# Altium schematic sheet pca63557_sheet3_motor.SchDoc: =BoardTitle
size A4; Organization: Nordic Semiconductor; DocumentNumber: 3; SheetNumber: 3; SheetTotal: 4; CompanyName: Nordic Semiconductor; DocumentSize: A4
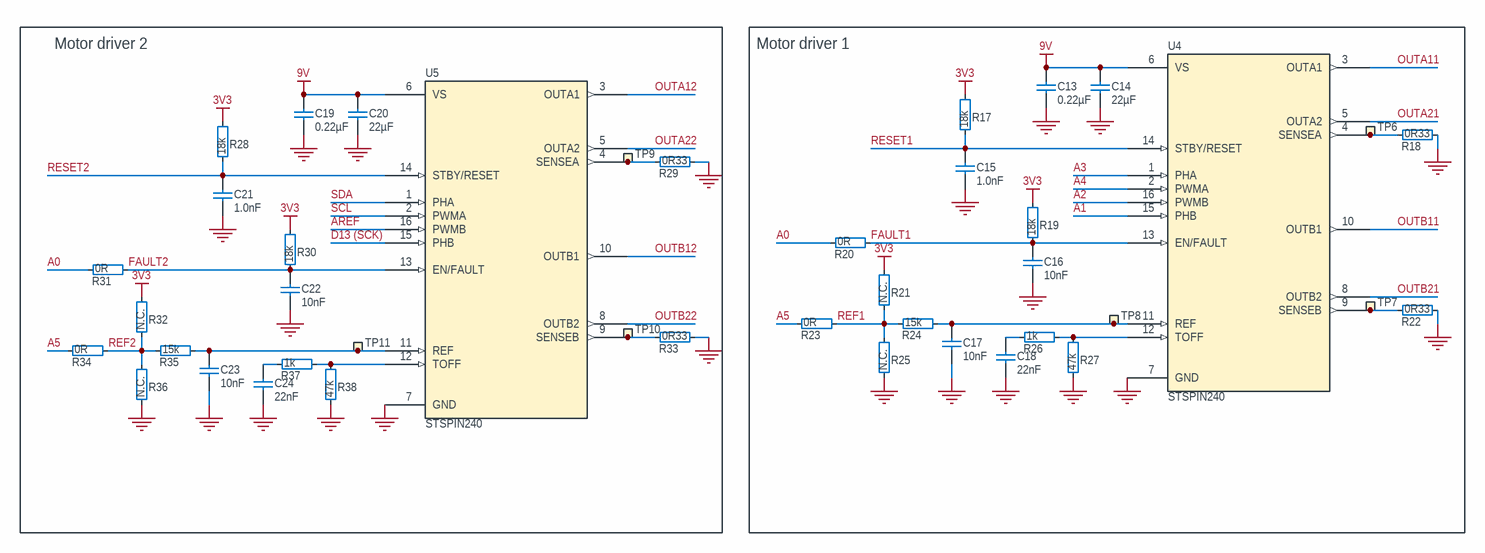
[diagram p0: pca63557_sheet3_motor.SchDoc]

## Parts
C13  0.22µF  [CAPC1005X04L]
C14  22µF  [CAPC1608X06L]
C15  1.0nF  [CAPC1005X04L]
C16  10nF  [CAPC1005X04L]
C17  10nF  [CAPC1005X04L]
C18  22nF  [CAPC1005X04L]
C19  0.22µF  [CAPC1005X04L]
C20  22µF  [CAPC1608X06L]
C21  1.0nF  [CAPC1005X04L]
C22  10nF  [CAPC1005X04L]
C23  10nF  [CAPC1005X04L]
C24  22nF  [CAPC1005X04L]
R17  18k  [RESC1005X04L]
R18  0R33  [RESC3216X08N]
R19  18k  [RESC1005X04L]
R20  0R  [RESC1005X04L]
R21  N.C.  [RESC1005X04L_NC]
R22  0R33  [RESC3216X08N]
R23  0R  [RESC1005X04L]
R24  15k  [RESC1005X04L]
R25  N.C.  [RESC1005X04L_NC]
R26  1k  [RESC1005X04L]
R27  47k  [RESC1005X04L]
R28  18k  [RESC1005X04L]
R29  0R33  [RESC3216X08N]
R30  18k  [RESC1005X04L]
R31  0R  [RESC1005X04L]
R32  N.C.  [RESC1005X04L_NC]
R33  0R33  [RESC3216X08N]
R34  0R  [RESC1005X04L]
R35  15k  [RESC1005X04L]
R36  N.C.  [RESC1005X04L_NC]
R37  1k  [RESC1005X04L]
R38  47k  [RESC1005X04L]
TP6  Ø1.5mm,SMD  [TP_SMD_D1.5mm]  (value not drawn)  (no BOM)
TP7  Ø1.5mm,SMD  [TP_SMD_D1.5mm]  (value not drawn)  (no BOM)
TP8  Ø1.5mm,SMD  [TP_SMD_D1.5mm]  (value not drawn)  (no BOM)
TP9  Ø1.5mm,SMD  [TP_SMD_D1.5mm]  (value not drawn)  (no BOM)
TP10  Ø1.5mm,SMD  [TP_SMD_D1.5mm]  (value not drawn)  (no BOM)
TP11  Ø1.5mm,SMD  [TP_SMD_D1.5mm]  (value not drawn)  (no BOM)
U4  STSPIN240  [STSPIN240]
U5  STSPIN240  [STSPIN240]

## Blocks framed on the sheet
Motor driver 2: C19-C24 R28-R38 TP9-TP11 U5
Motor driver 1: C13-C18 R17-R27 TP6-TP8 U4

## Nets
3V3: R17.2 R19.2 R21.2 R28.2 R30.2 R32.2
9V: C13.2 C14.2 C19.2 C20.2 U4.6(VS) U5.6(VS)
GND: C13.1 C14.1 C15.1 C16.1 C17.1 C18.1 C19.1 C20.1 C21.1 C22.1 C23.1 C24.1 R18.2 R22.2 R25.1 R27.1 R29.2 R33.2 R36.1 R38.1 U4.7(GND) U5.7(GND)
A0: R20.1 R31.1
A1: U4.15(PHB)
A2: U4.16(PWMB)
A3: U4.1(PHA)
A4: U4.2(PWMA)
A5: R23.1 R34.1
AREF: U5.16(PWMB)
D13 (SCK): U5.15(PHB)
FAULT1: C16.2 R19.1 R20.2 U4.13(EN/FAULT)
FAULT2: C22.2 R30.1 R31.2 U5.13(EN/FAULT)
OUTA11: U4.3(OUTA1)
OUTA12: U5.3(OUTA1)
OUTA21: U4.5(OUTA2)
OUTA22: U5.5(OUTA2)
OUTB11: U4.10(OUTB1)
OUTB12: U5.10(OUTB1)
OUTB21: U4.8(OUTB2)
OUTB22: U5.8(OUTB2)
REF1: R21.1 R23.2 R24.1 R25.2
REF2: R32.1 R34.2 R35.1 R36.2
RESET1: C15.2 R17.1 U4.14(STBY/RESET)
RESET2: C21.2 R28.1 U5.14(STBY/RESET)
SCL: U5.2(PWMA)
SDA: U5.1(PHA)
NetC17_2: C17.2 R24.2 TP8.1 U4.11(REF)
NetC18_2: C18.2 R26.1
NetC23_2: C23.2 R35.2 TP11.1 U5.11(REF)
NetC24_2: C24.2 R37.1
NetR18_1: R18.1 TP6.1 U4.4(SENSEA)
NetR22_1: R22.1 TP7.1 U4.9(SENSEB)
NetR26_2: R26.2 R27.2 U4.12(TOFF)
NetR29_1: R29.1 TP9.1 U5.4(SENSEA)
NetR33_1: R33.1 TP10.1 U5.9(SENSEB)
NetR37_2: R37.2 R38.2 U5.12(TOFF)

## Notes on the sheet
- Title
- Size
- Date:
- File:
- A4
- PCB Assembly Number
- Sheet         of
- Drawn By:
- Revision
- Classification:

## Library data of the parts
C13 C19 = C0402-0.22µ-16V-X7R-CL05B224KO5NNNC: Capacitor, X7R, ±0.10%, 16V; Manufacturer: Samsung Electro-Mechanics; Part number NEMS: 100200508; Component Status: Active; Pad Count: 2; Artikkelnr Noca: N.A.; Part Number: C0402-0.22µ-16V-X7R-CL05B224KO5NNNC; Component Class: Capacitors; Author: mam1; Manufacturer Part Number: CL05B224KO5NNNC; ComponentLink1URL: https://media.digikey.com/pdf/Data%20Sheets/Samsung%20PDFs/CL05B224KO5NNNC_Spec.pdf; ComponentLink1Description: Datasheet; ComponentLink2URL: https://www.digikey.no/en/products/detail/samsung-electro-mechanics/CL05B224KO5NNNC/3886834; ComponentLink2Description: Supplier link; HelpURL: N.A.; Footprint Doc: 0402; LatestRevisionDate: 2022-06-20; Published: 2022-06-20; Value: 0.22µF; Note: 16V; Supplier 1: Digi-Key; Supplier Part Number 1: 1276-1176-1-ND; Supplier 2: N.A.; Supplier Part Number 2: N.A.; Part number IPS: N.A.; Part number Norautron: N.A.; PartId: 100200508
C14 C20 = C0603-22µ-16V-X5R-CL10A226MO7JZNC: Capacitor, X5R, ±0.20%, 16V; Manufacturer: Samsung Electro-Mechanics; Part number NEMS: 100200507; Component Status: Active; Pad Count: 2; Artikkelnr Noca: N.A.; Part Number: C0603-22µ-16V-X5R-CL10A226MO7JZNC; Component Class: Capacitors; Author: mam1; Manufacturer Part Number: CL10A226MO7JZNC; ComponentLink1URL: https://media.digikey.com/pdf/Data%20Sheets/Samsung%20PDFs/CL10A226MO7JZNC_Spec.pdf; ComponentLink1Description: Datasheet; ComponentLink2URL: https://www.digikey.no/en/products/detail/samsung-electro-mechanics/CL10A226MO7JZNC/7320581; ComponentLink2Description: Supplier link; HelpURL: N.A.; Footprint Doc: 0603; LatestRevisionDate: 2022-06-20; Published: 2022-06-20; Value: 22µF; Note: 16V; Supplier 1: Digi-Key; Supplier Part Number 1: 1276-7076-1-ND; Supplier 2: N.A.; Supplier Part Number 2: N.A.; Part number IPS: N.A.; Part number Norautron: N.A.; PartId: 100200507
C15 C21 = C0402-1n0: Capacitor, X7R, ±10%; Manufacturer: N.A.; Part number NEMS: 100200162; Component Status: Active; Pad Count: 2; Note: 50V; Artikkelnr Noca: 20039223; Part Number: C0402-1n0; PartId: 100200162; Component Class: Capacitors; Author: rsk; Manufacturer Part Number: N.A.; ComponentLink1URL: N.A.; ComponentLink1Description: Datasheet; ComponentLink2URL: N.A.; ComponentLink2Description: Supplier link; HelpURL: N.A.; Footprint Doc: 0402; LatestRevisionDate: 2009-11-23; Published: 2009-05-08; Value: 1.0nF; Supplier 1: N.A.; Supplier Part Number 1: N.A.; Supplier 2: N.A.; Supplier Part Number 2: N.A.; Part number IPS: N.A.; Part number Norautron: N.A.
C16 C17 C22 C23 = C0402-10n: Capacitor, X7R, ±10%; Manufacturer: N.A.; Part number IPS: 00000007784; Part number NEMS: 100200173; Component Status: Active; Pad Count: 2; Note: 16V; Artikkelnr Noca: 20039166; Part Number: C0402-10n; PartId: 100200173; Component Class: Capacitors; Author: rsk; Manufacturer Part Number: N.A.; ComponentLink1URL: N.A.; ComponentLink1Description: Datasheet; ComponentLink2URL: N.A.; ComponentLink2Description: Supplier link; HelpURL: N.A.; Footprint Doc: 0402; LatestRevisionDate: 2009-11-23; Published: 2009-05-08; Value: 10nF; Supplier 1: N.A.; Supplier Part Number 1: N.A.; Supplier 2: N.A.; Supplier Part Number 2: N.A.; Part number Norautron: N.A.
C18 C24 = C0402-22n: Capacitor, X7R, ±10%; Manufacturer: N.A.; Part number NEMS: 100200177; Component Status: Active; Pad Count: 2; Note: 50V; Artikkelnr Noca: 20039316; Part Number: C0402-22n; PartId: 100200177; Component Class: Capacitors; Author: rsk; Manufacturer Part Number: N.A.; ComponentLink1URL: N.A.; ComponentLink1Description: Datasheet; ComponentLink2URL: N.A.; ComponentLink2Description: Supplier link; HelpURL: N.A.; Footprint Doc: 0402; LatestRevisionDate: 2009-05-08; Published: 2009-05-08; Value: 22nF; Supplier 1: N.A.; Supplier Part Number 1: N.A.; Supplier 2: N.A.; Supplier Part Number 2: N.A.; Part number IPS: N.A.; Part number Norautron: N.A.
R17 R19 R28 R30 = R0402-18k: Resistor, ±1%, 0.063W; Manufacturer: N.A.; Part number IPS: 00000003300; Part number NEMS: 100100208; Component Status: Active; Pad Count: 2; Note: Chip Res 1%; Artikkelnr Noca: 27049103; Part Number: R0402-18k; PartId: 100100208; Component Class: Resistors; Author: rsk; Manufacturer Part Number: N.A.; ComponentLink1URL: N.A.; ComponentLink1Description: Datasheet; ComponentLink2URL: N.A.; ComponentLink2Description: Supplier link; HelpURL: N.A.; Footprint Doc: 0402; LatestRevisionDate: 2009-11-23; Published: 2009-05-08; Value: 18k; Supplier 1: Farnell; Supplier Part Number 1: 173-8867; Supplier 2: N.A.; Supplier Part Number 2: N.A.; Part number Norautron: N.A.
R18 R22 R29 R33 = R1206-0R33-0.5%-1W-HRG3216P-3300-D-T1: 330 Ohms ±0.5% 1W Chip Resistor 1206 (3216 Metric); Manufacturer: Susumu; Part number NEMS: 100100668; Component Status: Active; Pad Count: 2; Note: 0R33 0.5% 1W; Artikkelnr Noca: N.A.; Part Number: R1206-0R33-0.5%-1W-HRG3216P-3300-D-T1; Component Class: Resistors; Author: mam1; Manufacturer Part Number: HRG3216P-3300-D-T1; ComponentLink1URL: https://www.susumu.co.jp/common/pdf/n_catalog_partition24_en.pdf; ComponentLink1Description: Datasheet; ComponentLink2URL: https://www.digikey.no/en/products/detail/susumu/HRG3216P-3300-D-T1/5762512; ComponentLink2Description: Supplier link; HelpURL: N.A.; Footprint Doc: 1206; LatestRevisionDate: 2022-06-20; Published: 2022-06-20; Value: 0R33; Supplier 1: Digi-Key; Supplier Part Number 1: 408-1913-1-ND; Supplier 2: N.A.; Supplier Part Number 2: N.A.; Part number IPS: N.A.; Part number Norautron: N.A.; PartId: 100100668
R20 R23 R31 R34 = R0402-0R: Resistor, ±5%, 0.063W; Manufacturer: N.A.; Part number IPS: 00000007128; Part number NEMS: 100100109; Component Status: Active; Pad Count: 2; Note: Chip Res 5%; Artikkelnr Noca: 27049000; Part Number: R0402-0R; PartId: 100100109; Component Class: Resistors; Author: rsk; Manufacturer Part Number: N.A.; ComponentLink1URL: N.A.; ComponentLink1Description: Datasheet; ComponentLink2URL: N.A.; ComponentLink2Description: Supplier link; HelpURL: N.A.; Footprint Doc: 0402; LatestRevisionDate: 2009-11-23; Published: 2009-05-08; Value: 0R; Supplier 1: Farnell; Supplier Part Number 1: 146-9661; Supplier 2: N.A.; Supplier Part Number 2: N.A.; Part number Norautron: N.A.
R21 R25 R32 R36 = R0402-N.C.: Not mounted; Manufacturer: N.A.; Part number NEMS: 100100281; Component Status: Active; Pad Count: 2; Note: Chip Res; Assembly: Not mounted; Part Number: R0402-N.C.; PartId: 100100281; Component Class: Resistors; Author: rsk; Manufacturer Part Number: N.A.; ComponentLink1URL: N.A.; ComponentLink1Description: Datasheet; ComponentLink2URL: N.A.; ComponentLink2Description: Supplier link; HelpURL: N.A.; Footprint Doc: 0402; LatestRevisionDate: 2009-05-08; Published: 2009-05-08; Value: N.C.; Supplier 1: N.A.; Supplier Part Number 1: N.A.; Supplier 2: N.A.; Supplier Part Number 2: N.A.; Artikkelnr Noca: N.A.; Part number IPS: N.A.; Part number Norautron: N.A.
R24 R35 = R0402-15k: Resistor, ±1%, 0.063W; Manufacturer: N.A.; Part number IPS: 00000002098; Part number NEMS: 100100206; Component Status: Active; Pad Count: 2; Note: Chip Res 1%; Artikkelnr Noca: 27049101; Part Number: R0402-15k; PartId: 100100206; Component Class: Resistors; Author: rsk; Manufacturer Part Number: N.A.; ComponentLink1URL: N.A.; ComponentLink1Description: Datasheet; ComponentLink2URL: N.A.; ComponentLink2Description: Supplier link; HelpURL: N.A.; Footprint Doc: 0402; LatestRevisionDate: 2009-11-23; Published: 2009-05-08; Value: 15k; Supplier 1: Farnell; Supplier Part Number 1: 173-8866; Supplier 2: N.A.; Supplier Part Number 2: N.A.; Part number Norautron: N.A.
R26 R37 = R0402-1k0: Resistor, ±1%, 0.063W; Manufacturer: N.A.; Part number IPS: 00000002218; Part number NEMS: 100100171; Component Status: Active; Pad Count: 2; Note: Chip Res 1%; Artikkelnr Noca: 27049073; Part Number: R0402-1k0; PartId: 100100171; Component Class: Resistors; Author: rsk; Manufacturer Part Number: N.A.; ComponentLink1URL: N.A.; ComponentLink1Description: Datasheet; ComponentLink2URL: N.A.; ComponentLink2Description: Supplier link; HelpURL: N.A.; Footprint Doc: 0402; LatestRevisionDate: 2009-11-23; Published: 2009-05-08; Value: 1k; Supplier 1: Farnell; Supplier Part Number 1: 173-8850; Supplier 2: N.A.; Supplier Part Number 2: N.A.; Part number Norautron: N.A.
R27 R38 = R0402-47k: Resistor, ±1%, 0.063W; Manufacturer: N.A.; Part number NEMS: 100100224; Component Status: Active; Pad Count: 2; Note: Chip Res 1%; Artikkelnr Noca: 27049113; Part Number: R0402-47k; PartId: 100100224; Component Class: Resistors; Author: rsk; Manufacturer Part Number: N.A.; ComponentLink1URL: N.A.; ComponentLink1Description: Datasheet; ComponentLink2URL: N.A.; ComponentLink2Description: Supplier link; HelpURL: N.A.; Footprint Doc: 0402; LatestRevisionDate: 2009-11-23; Published: 2009-05-08; Value: 47k; Supplier 1: Farnell; Supplier Part Number 1: 146-9719; Supplier 2: N.A.; Supplier Part Number 2: N.A.; Part number IPS: N.A.; Part number Norautron: N.A.
TP6-TP11 = TP_SMD_Ø1.5MM: 1.5mm circular SMD testpad; Manufacturer: Nordic Semiconductor; Manufacturer Part Number: N.A.; Part number NEMS: 100500477; Component Status: Active; Pad Count: 1; Part Number: TP_SMD_Ø1.5MM; PartId: 100500477; Component Class: Connectors; Author: rsk; ComponentLink1URL: N.A.; ComponentLink1Description: Datasheet; ComponentLink2URL: N.A.; ComponentLink2Description: Supplier link; HelpURL: N.A.; Footprint Doc: TP_SMD_Ø1.5mm; LatestRevisionDate: 2021-03-05; Published: 2016-06-02; Value: Ø1.5mm,SMD; Note: N.A.; Supplier 1: N.A.; Supplier Part Number 1: N.A.; Supplier 2: N.A.; Supplier Part Number 2: N.A.; Artikkelnr Noca: N.A.; Part number IPS: N.A.; Part number Norautron: N.A.
U4 U5 = STSPIN240: LOW VOLTAGE DUAL BRUSH DC MOTOR; Manufacturer: STMicroelectronics; Part number NEMS: 101900705; Component Status: Active; Pad Count: 17; Note: N.A.; Supplier 1: Digi-Key; Manufacturer Part Number: STSPIN240; ComponentLink1URL: https://www.st.com/content/ccc/resource/technical/document/datasheet/group3/2f/ef/09/12/89/cd/41/c8/DM00293532/files/DM00293532.pdf/jcr:content/translations/en.DM00293532.pdf; ComponentLink1Description: Datasheet; ComponentLink2URL: https://www.digikey.no/no/products/detail/stmicroelectronics/STSPIN240/6137576?s=N4IgTCBcDaIM4Bc4AcCWA7MAWADCAugL5A; ComponentLink2Description: Supplier link; Supplier Part Number 1: 497-16604-1-ND; Part Number: STSPIN240; PartId: 101900705; Component Class: Misc_ICs; Author: mam1; HelpURL: N.A.; Footprint Doc: STSPIN240; LatestRevisionDate: 2022-06-20; Published: 2022-06-15; Value: STSPIN240; Supplier 2: N.A.; Supplier Part Number 2: N.A.; Artikkelnr Noca: N.A.; Part number IPS: N.A.; Part number Norautron: N.A.